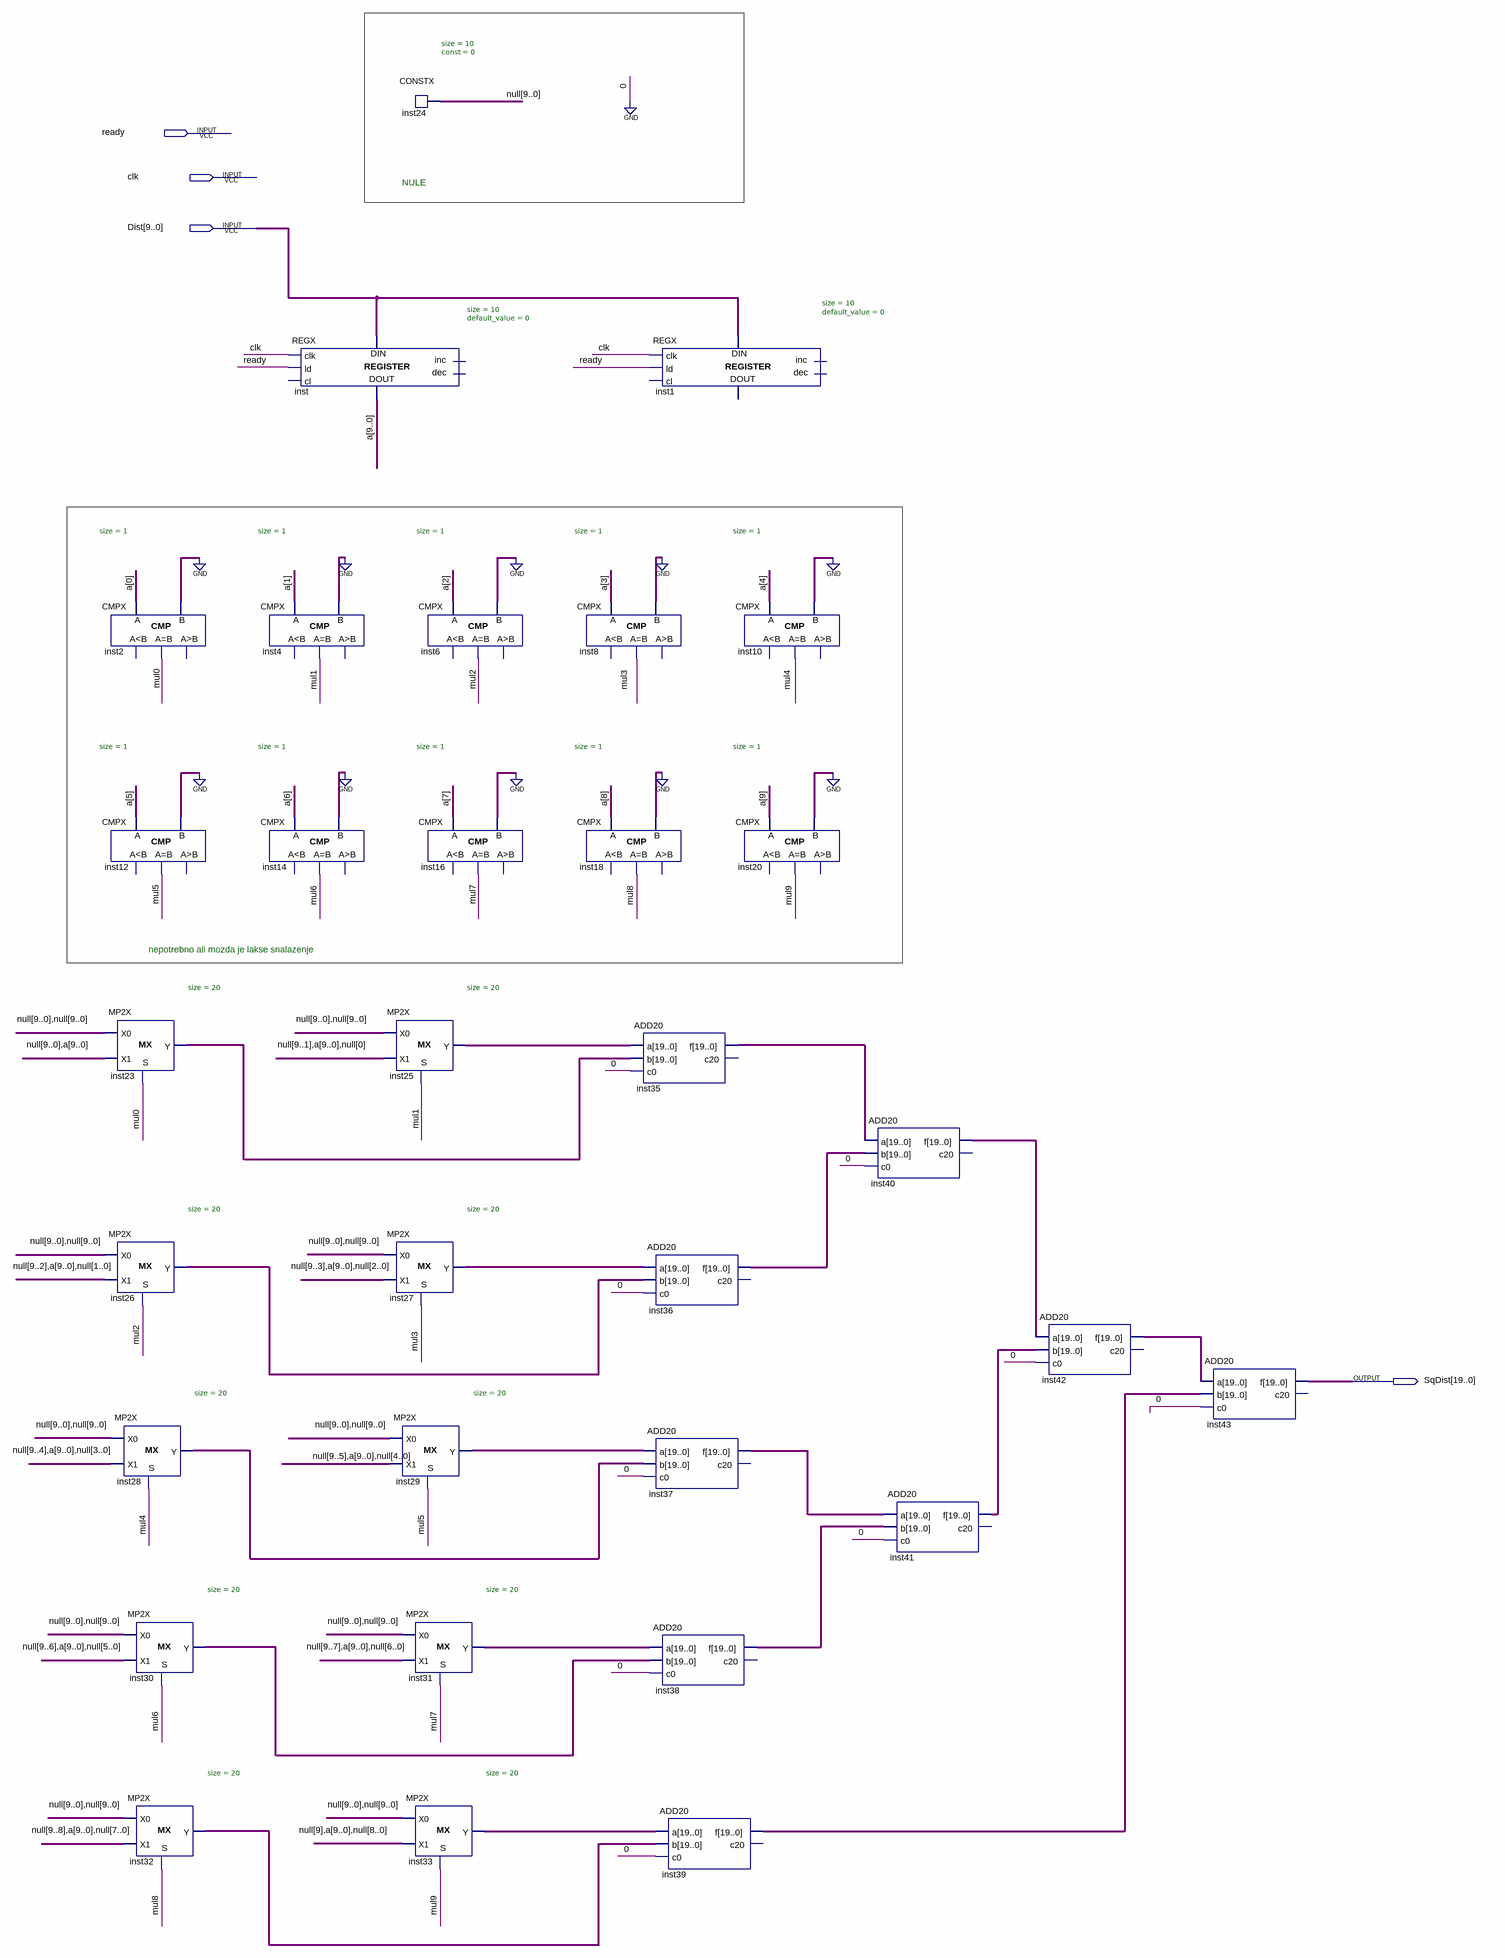
[diagram p0: schematic sheet]
// Quartus schematic Cuber.bdf as structural Verilog: 32 symbols, 4 pins
module Cuber (
  input  ready,
  input  clk,
  input  [9:0] Dist,
  output [19:0] SqDist
);

  wire mul0, mul1, mul2, mul3, mul4, mul5, mul6, mul7, mul8, mul9;
  wire [9:0] a, \null ;
  wire [19:0] inst23_y, inst25_y, inst26_y, inst27_y, inst28_y, inst29_y, inst30_y, inst31_y, inst32_y,
       inst33_y, inst35_f, inst36_f, inst37_f, inst38_f, inst39_f, inst40_f, inst41_f, inst42_f;

  CMPX #(.size(1)) inst2 (.A(a[0]), .B(1'b0), .eq(mul0));  // open: ls, gr
  CMPX #(.size(1)) inst12 (.A(a[5]), .B(1'b0), .eq(mul5));  // open: ls, gr
  MP2X #(.size(20)) inst23 (.S(mul0), .X0({\null , \null }), .X1({\null , a}), .Y(inst23_y));
  MP2X #(.size(20)) inst26 (.S(mul2), .X0({\null , \null }), .X1({\null [9:2], a, \null [1:0]}), .Y(inst26_y));
  MP2X #(.size(20)) inst28 (.S(mul4), .X0({\null , \null }), .X1({\null [9:4], a, \null [3:0]}), .Y(inst28_y));
  MP2X #(.size(20)) inst30 (.S(mul6), .X0({\null , \null }), .X1({\null [9:6], a, \null [5:0]}), .Y(inst30_y));
  MP2X #(.size(20)) inst32 (.S(mul8), .X0({\null , \null }), .X1({\null [9:8], a, \null [7:0]}), .Y(inst32_y));
  CMPX #(.size(1)) inst4 (.A(a[1]), .B(1'b0), .eq(mul1));  // open: ls, gr
  CMPX #(.size(1)) inst14 (.A(a[6]), .B(1'b0), .eq(mul6));  // open: ls, gr
  REGX #(.size(10), .default_value(0)) inst (
    .clk(clk), .ld(ready), .data_in(Dist), .data_out(a));  // open: cl, inc, dec
  CONSTX #(.size(10), .\const (0)) inst24 (.data(\null ));
  CMPX #(.size(1)) inst6 (.A(a[2]), .B(1'b0), .eq(mul2));  // open: ls, gr
  CMPX #(.size(1)) inst16 (.A(a[7]), .B(1'b0), .eq(mul7));  // open: ls, gr
  MP2X #(.size(20)) inst25 (.S(mul1), .X0({\null , \null }), .X1({\null [9:1], a, \null [0]}), .Y(inst25_y));
  MP2X #(.size(20)) inst27 (.S(mul3), .X0({\null , \null }), .X1({\null [9:3], a, \null [2:0]}), .Y(inst27_y));
  MP2X #(.size(20)) inst29 (.S(mul5), .X0({\null , \null }), .X1({\null [9:5], a, \null [4:0]}), .Y(inst29_y));
  MP2X #(.size(20)) inst31 (.S(mul7), .X0({\null , \null }), .X1({\null [9:7], a, \null [6:0]}), .Y(inst31_y));
  MP2X #(.size(20)) inst33 (.S(mul9), .X0({\null , \null }), .X1({\null [9], a, \null [8:0]}), .Y(inst33_y));
  CMPX #(.size(1)) inst8 (.A(a[3]), .B(1'b0), .eq(mul3));  // open: ls, gr
  CMPX #(.size(1)) inst18 (.A(a[8]), .B(1'b0), .eq(mul8));  // open: ls, gr
  REGX #(.size(10), .default_value(0)) inst1 (.clk(clk), .ld(ready), .data_in(Dist));  // open: cl, inc, dec, data_out
  ADD20 inst35 (.a(inst25_y), .b(inst23_y), .c0(1'b0), .f(inst35_f));  // open: c20
  ADD20 inst36 (.a(inst27_y), .b(inst26_y), .c0(1'b0), .f(inst36_f));  // open: c20
  ADD20 inst37 (.a(inst29_y), .b(inst28_y), .c0(1'b0), .f(inst37_f));  // open: c20
  ADD20 inst38 (.a(inst31_y), .b(inst30_y), .c0(1'b0), .f(inst38_f));  // open: c20
  ADD20 inst39 (.a(inst33_y), .b(inst32_y), .c0(1'b0), .f(inst39_f));  // open: c20
  CMPX #(.size(1)) inst10 (.A(a[4]), .B(1'b0), .eq(mul4));  // open: ls, gr
  CMPX #(.size(1)) inst20 (.A(a[9]), .B(1'b0), .eq(mul9));  // open: ls, gr
  ADD20 inst40 (.a(inst35_f), .b(inst36_f), .c0(1'b0), .f(inst40_f));  // open: c20
  ADD20 inst41 (.a(inst37_f), .b(inst38_f), .c0(1'b0), .f(inst41_f));  // open: c20
  ADD20 inst42 (.a(inst40_f), .b(inst41_f), .c0(1'b0), .f(inst42_f));  // open: c20
  ADD20 inst43 (.a(inst42_f), .b(inst39_f), .c0(1'b0), .f(SqDist));  // open: c20

  // Notes on the sheet:
  //   NULE
  //   nepotrebno ali mozda je lakse snalazenje
endmodule
